# EAGLE design W021B (EAGLE 6.6.0)
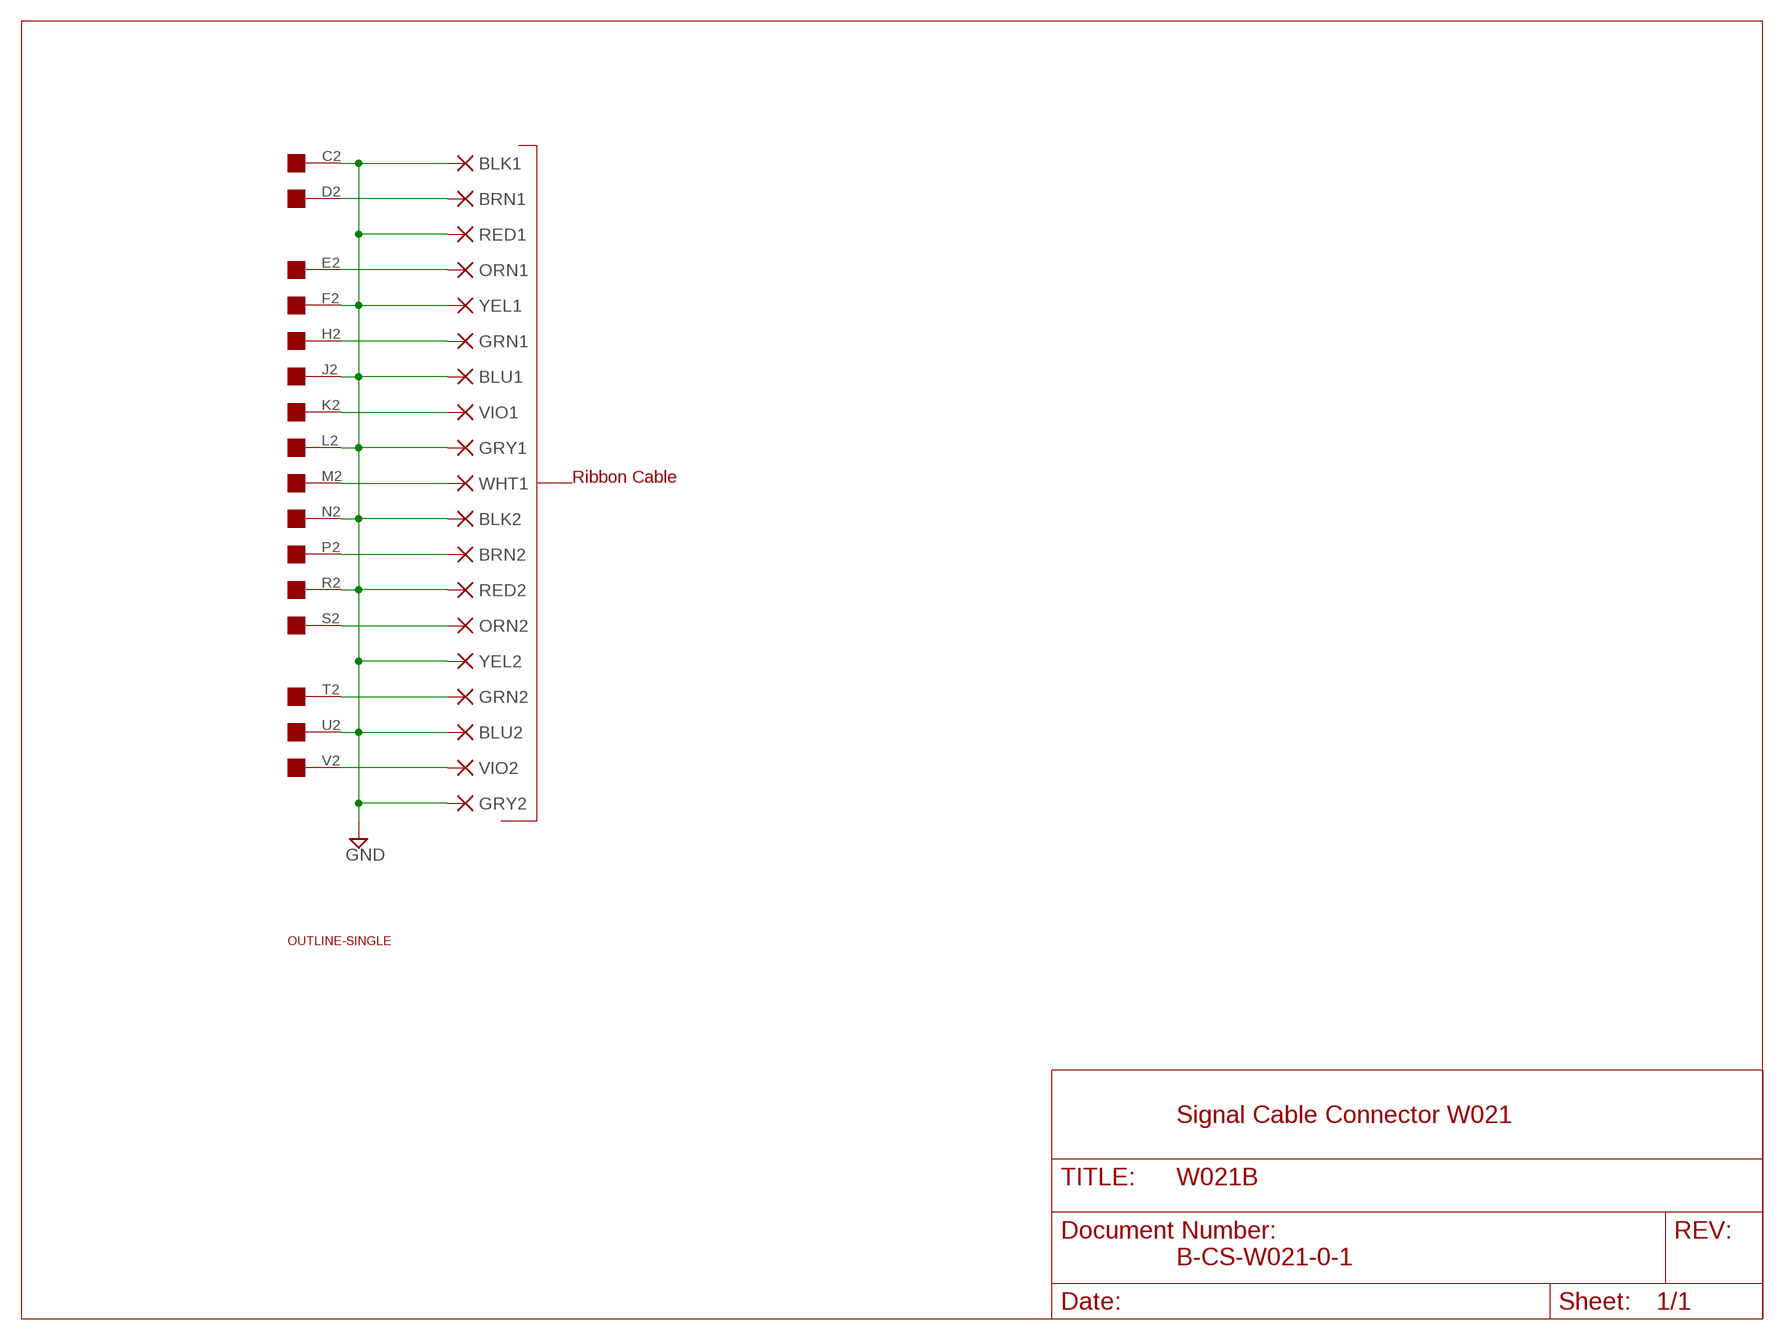
[diagram p0: schematic, sheet 1]

## Parts
BLK1  PAD-0465  [0465]
BLK2  PAD-0465  [0465]
BLU1  PAD-0465  [0465]
BLU2  PAD-0465  [0465]
BRN1  PAD-0465  [0465]
BRN2  PAD-0465  [0465]
GRN1  PAD-0465  [0465]
GRN2  PAD-0465  [0465]
GRY1  PAD-0465  [0465]
GRY2  PAD-0465  [0465]
ORN1  PAD-0465  [0465]
ORN2  PAD-0465  [0465]
RED1  PAD-0465  [0465]
RED2  PAD-0465  [0465]
U$1  OUTLINE-SINGLE  [SINGLE]
U$2  EDGE-1  [EDGE-CON1]
VIO1  PAD-0465  [0465]
VIO2  PAD-0465  [0465]
WHT1  PAD-0465  [0465]
YEL1  PAD-0465  [0465]
YEL2  PAD-0465  [0465]

## Nets
GND [Supply]: BLK1.P$1(P) BLK2.P$1(P) BLU1.P$1(P) BLU2.P$1(P) GRY1.P$1(P) GRY2.P$1(P) RED1.P$1(P) RED2.P$1(P) U$2.C2 U$2.F2 U$2.J2 U$2.L2 U$2.N2 U$2.R2 U$2.U2 YEL1.P$1(P) YEL2.P$1(P)
N$1 [Supply]: ORN1.P$1(P) U$2.E2
N$2 [Supply]: GRN1.P$1(P) U$2.H2
N$3 [Supply]: U$2.K2 VIO1.P$1(P)
N$4 [Supply]: U$2.M2 WHT1.P$1(P)
N$5 [Supply]: BRN2.P$1(P) U$2.P2
N$6 [Supply]: ORN2.P$1(P) U$2.S2
N$7 [Supply]: GRN2.P$1(P) U$2.T2
N$8 [Supply]: U$2.V2 VIO2.P$1(P)
N$9: BRN1.P$1(P) U$2.D2
Unconnected: U$2.A2 U$2.B2

## Notes on the sheet
- Ribbon Cable
- Signal Cable Connector W021
- B-CS-W021-0-1

## Library data of the parts
BLK1 BLK2 BLU1 BLU2 BRN1 BRN2 GRN1 GRN2 GRY1 GRY2 ORN1 ORN2 RED1 RED2 VIO1 VIO2 WHT1 YEL1 YEL2 = dec-con:PAD: WIRE PAD Standard US Drill Sizes
U$1 = dec-con:OUTLINE-*: Board outlines for DEC boards.
U$2 = dec-con:EDGE-1: Single-Sided DEC Edge Connector -- (side 2)

## Net classes
1 Supply: width 0.813 mm

## Board
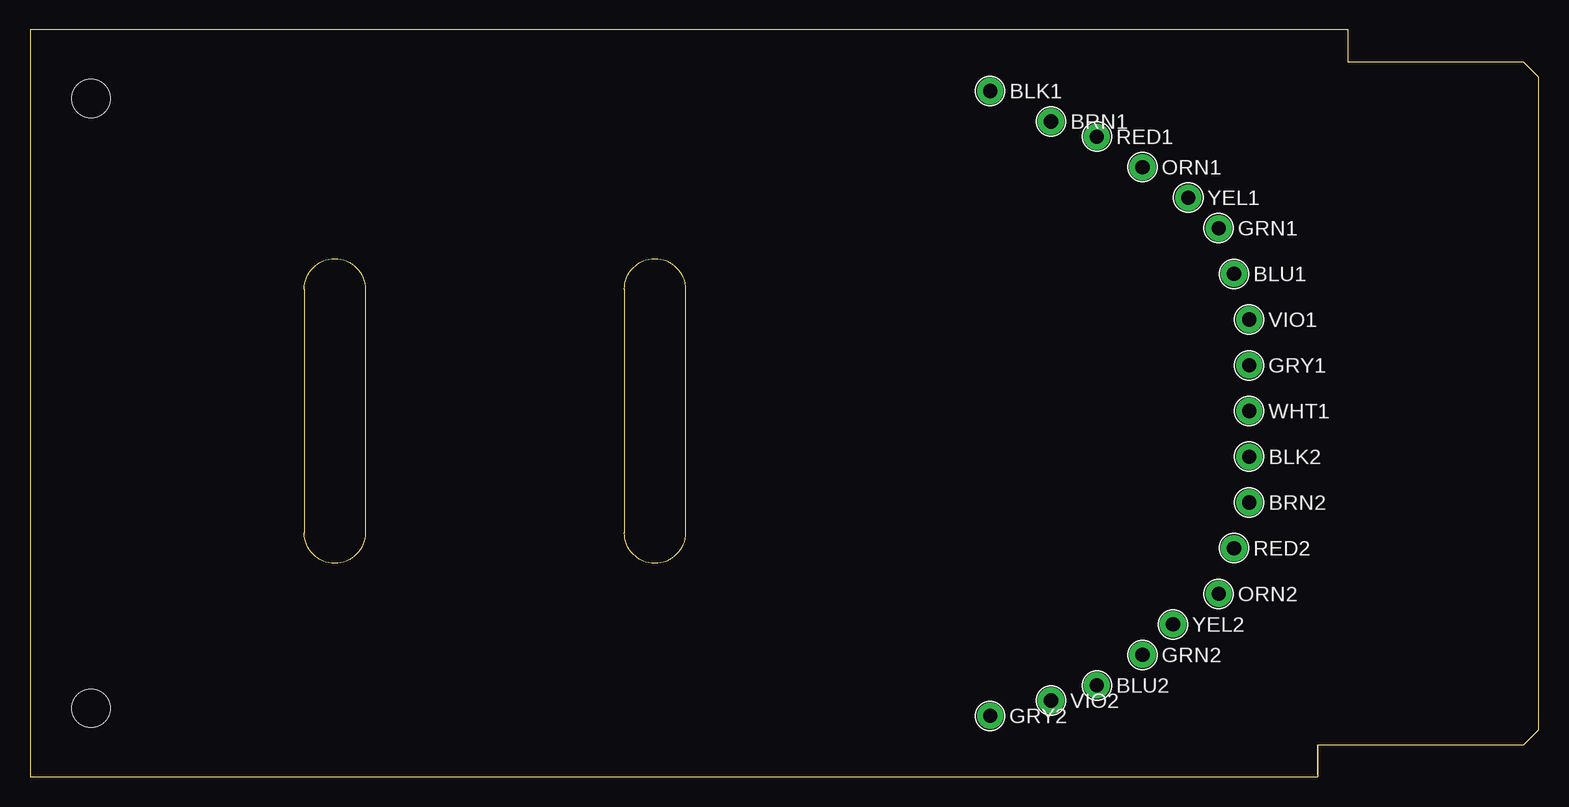
[diagram p1: board, top side]
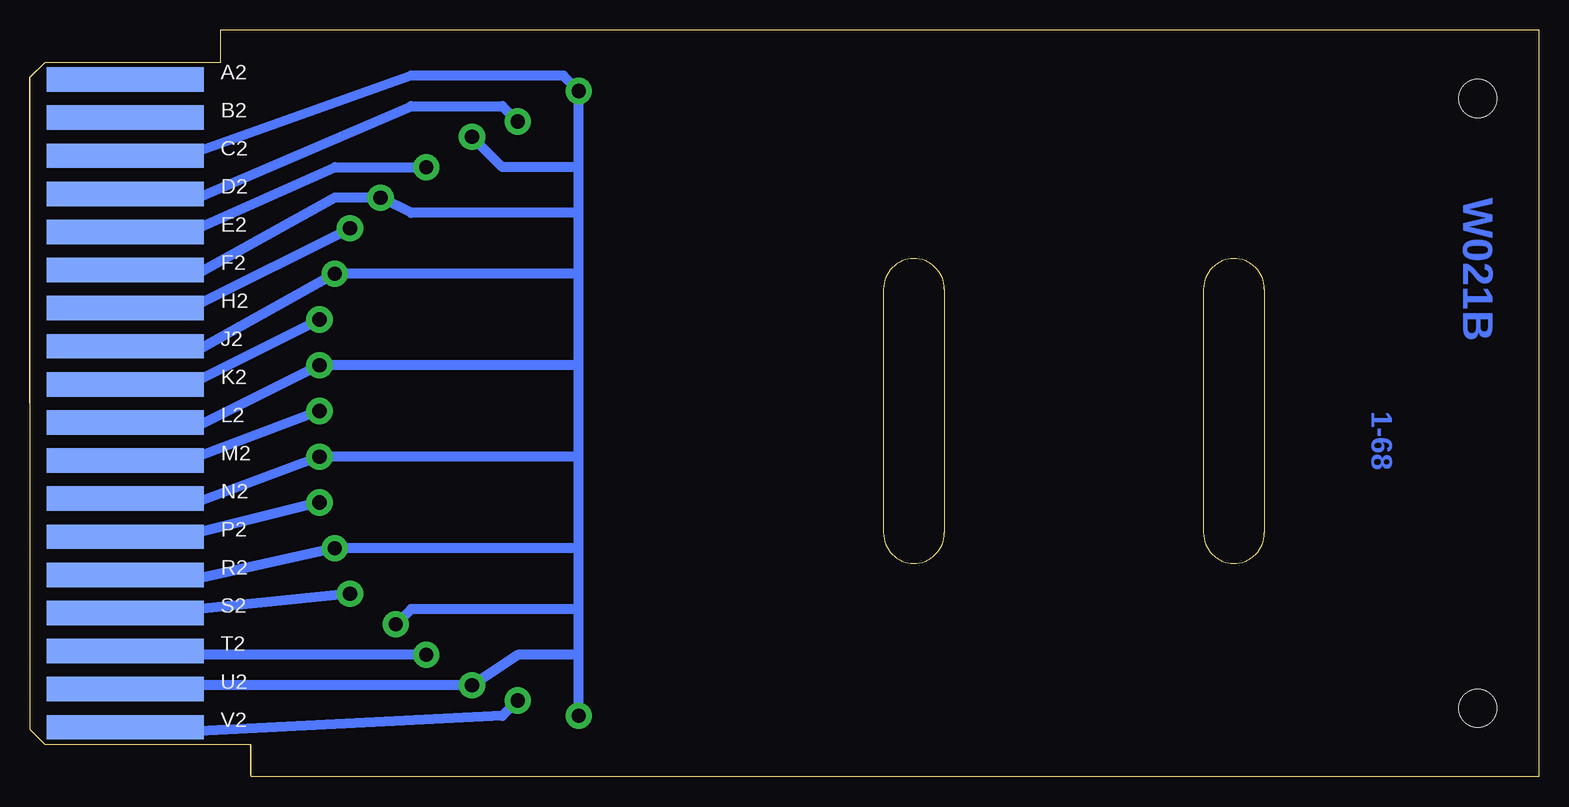
[diagram p2: board, bottom side, seen from below]

Size 125.73 x 62.23 mm. Coordinates in mm from the lower left corner, seen from the top.
Outline: 22.86,40.64 arc-180 27.94,40.64 27.94,20.32 arc-180 22.86,20.32 22.86,40.64
Outline: 49.53,40.64 arc-180 54.61,40.64 54.61,20.32 arc-180 49.53,20.32 49.53,40.64
Copper layers (1+16): Top 0.035mm / dielectric 1.5mm / Bottom 0.035mm
Design rules "16mils": minimum track width 16mil, minimum drill 32mil, track to track 15mil, track to pad 10mil, pad to pad 10mil, via to via 10mil, smd to smd 10mil, copper to edge 25mil, drill to drill 10mil, minimum pad ring 10mil, minimum via ring 8mil, stop-mask expansion 0mil, vias tented up to drill 0mil, thermal gap 10mil

### Footprints (pad centres in the part's own frame; a part is rotated, then mirrored left to right if it is on the bottom)
0465 = drill 1.181 pad 2.184: P$1 0,0
SINGLE = hole 3.175: 120.65,56.515; 120.65,5.715
EDGE-CON1 = smd 13.106 x 2.032 bottom: A2 7.938,4.128; B2 7.938,7.303; C2 7.938,10.477; D2 7.938,13.652; E2 7.938,16.828; F2 7.938,20.003; H2 7.938,23.177; J2 7.938,26.352; K2 7.938,29.527; L2 7.938,32.703; M2 7.938,35.877; N2 7.938,39.053; P2 7.938,42.227; R2 7.938,45.403; S2 7.938,48.578; T2 7.938,51.752; U2 7.938,54.928; V2 7.938,58.102

### Placement (x,y rotation side)
BLK1  80.01,57.15 0 top
BLK2  101.6,26.67 0 top
BLU1  100.33,41.91 0 top
BLU2  88.9,7.62 0 top
BRN1  85.09,54.61 0 top
BRN2  101.6,22.86 0 top
GRN1  99.06,45.72 0 top
GRN2  92.71,10.16 0 top
GRY1  101.6,34.29 0 top
GRY2  80.01,5.08 0 top
ORN1  92.71,50.8 0 top
ORN2  99.06,15.24 0 top
RED1  88.9,53.34 0 top
RED2  100.33,19.05 0 top
U$1  125.73,62.23 180 top
U$2  125.73,62.23 180 top
VIO1  101.6,38.1 0 top
VIO2  85.09,6.35 0 top
WHT1  101.6,30.48 0 top
YEL1  96.52,48.26 0 top
YEL2  95.25,12.7 0 top

### Tracks (layer width: path | path; a pad name or v marks a point on that pad's centre or on a via)
GND
  Bottom 0.813: GRY2.P$1 80.01,10.16 | 80.01,10.16 80.01,13.97 | 80.01,13.97 80.01,19.05 | 80.01,19.05 80.01,26.67 | 80.01,26.67 80.01,34.29 | 80.01,34.29 80.01,41.91 | 80.01,41.91 80.01,46.99 | 80.01,46.99 80.01,50.8 | 80.01,50.8 BLK1.P$1 81.28,58.42 93.98,58.42 111.76,52.07 116.84,52.07 U$2.C2 | U$2.L2 116.84,29.21 111.76,29.21 GRY1.P$1 80.01,34.29 | U$2.N2 116.84,22.86 111.76,22.86 BLK2.P$1 80.01,26.67 | U$2.U2 116.84,7.62 BLU2.P$1 85.09,10.16 80.01,10.16 | YEL2.P$1 93.98,13.97 80.01,13.97 | 80.01,19.05 RED2.P$1 111.76,16.51 116.84,16.51 U$2.R2 | 80.01,41.91 BLU1.P$1 111.76,35.56 116.84,35.56 U$2.J2 | 80.01,46.99 93.98,46.99 YEL1.P$1 100.33,48.26 111.76,41.91 116.84,41.91 U$2.F2 | RED1.P$1 86.36,50.8 80.01,50.8
N$1
  Bottom 0.813: U$2.E2 116.84,45.72 111.76,45.72 100.33,50.8 ORN1.P$1
N$2
  Bottom 0.813: U$2.H2 116.84,39.37 111.76,39.37 GRN1.P$1
N$3
  Bottom 0.813: U$2.K2 116.84,33.02 111.76,33.02 VIO1.P$1
N$4
  Bottom 0.813: U$2.M2 116.84,26.67 111.76,26.67 WHT1.P$1
N$5
  Bottom 0.813: U$2.P2 117.17,19.99 116.84,20.32 111.76,20.32 BRN2.P$1
N$6
  Bottom 0.813: U$2.S2 116.84,13.97 111.76,13.97 ORN2.P$1
N$7
  Bottom 0.813: U$2.T2 116.84,10.16 GRN2.P$1
N$8
  Bottom 0.813: U$2.V2 116.84,3.81 111.76,3.81 86.36,5.08 VIO2.P$1
N$9
  Bottom 0.813: U$2.D2 116.84,48.26 111.76,48.26 93.98,55.88 86.36,55.88 BRN1.P$1

### Text on the board
Bottom: W021B | 1-68
200bmp: C:/Users/Vince/Documents/websvn/trunk/Eagle/projects/DEC/Wxxx/W021/W021Abackfb.bmp